# EAGLE design FLD Logic (EAGLE 6.5.0)
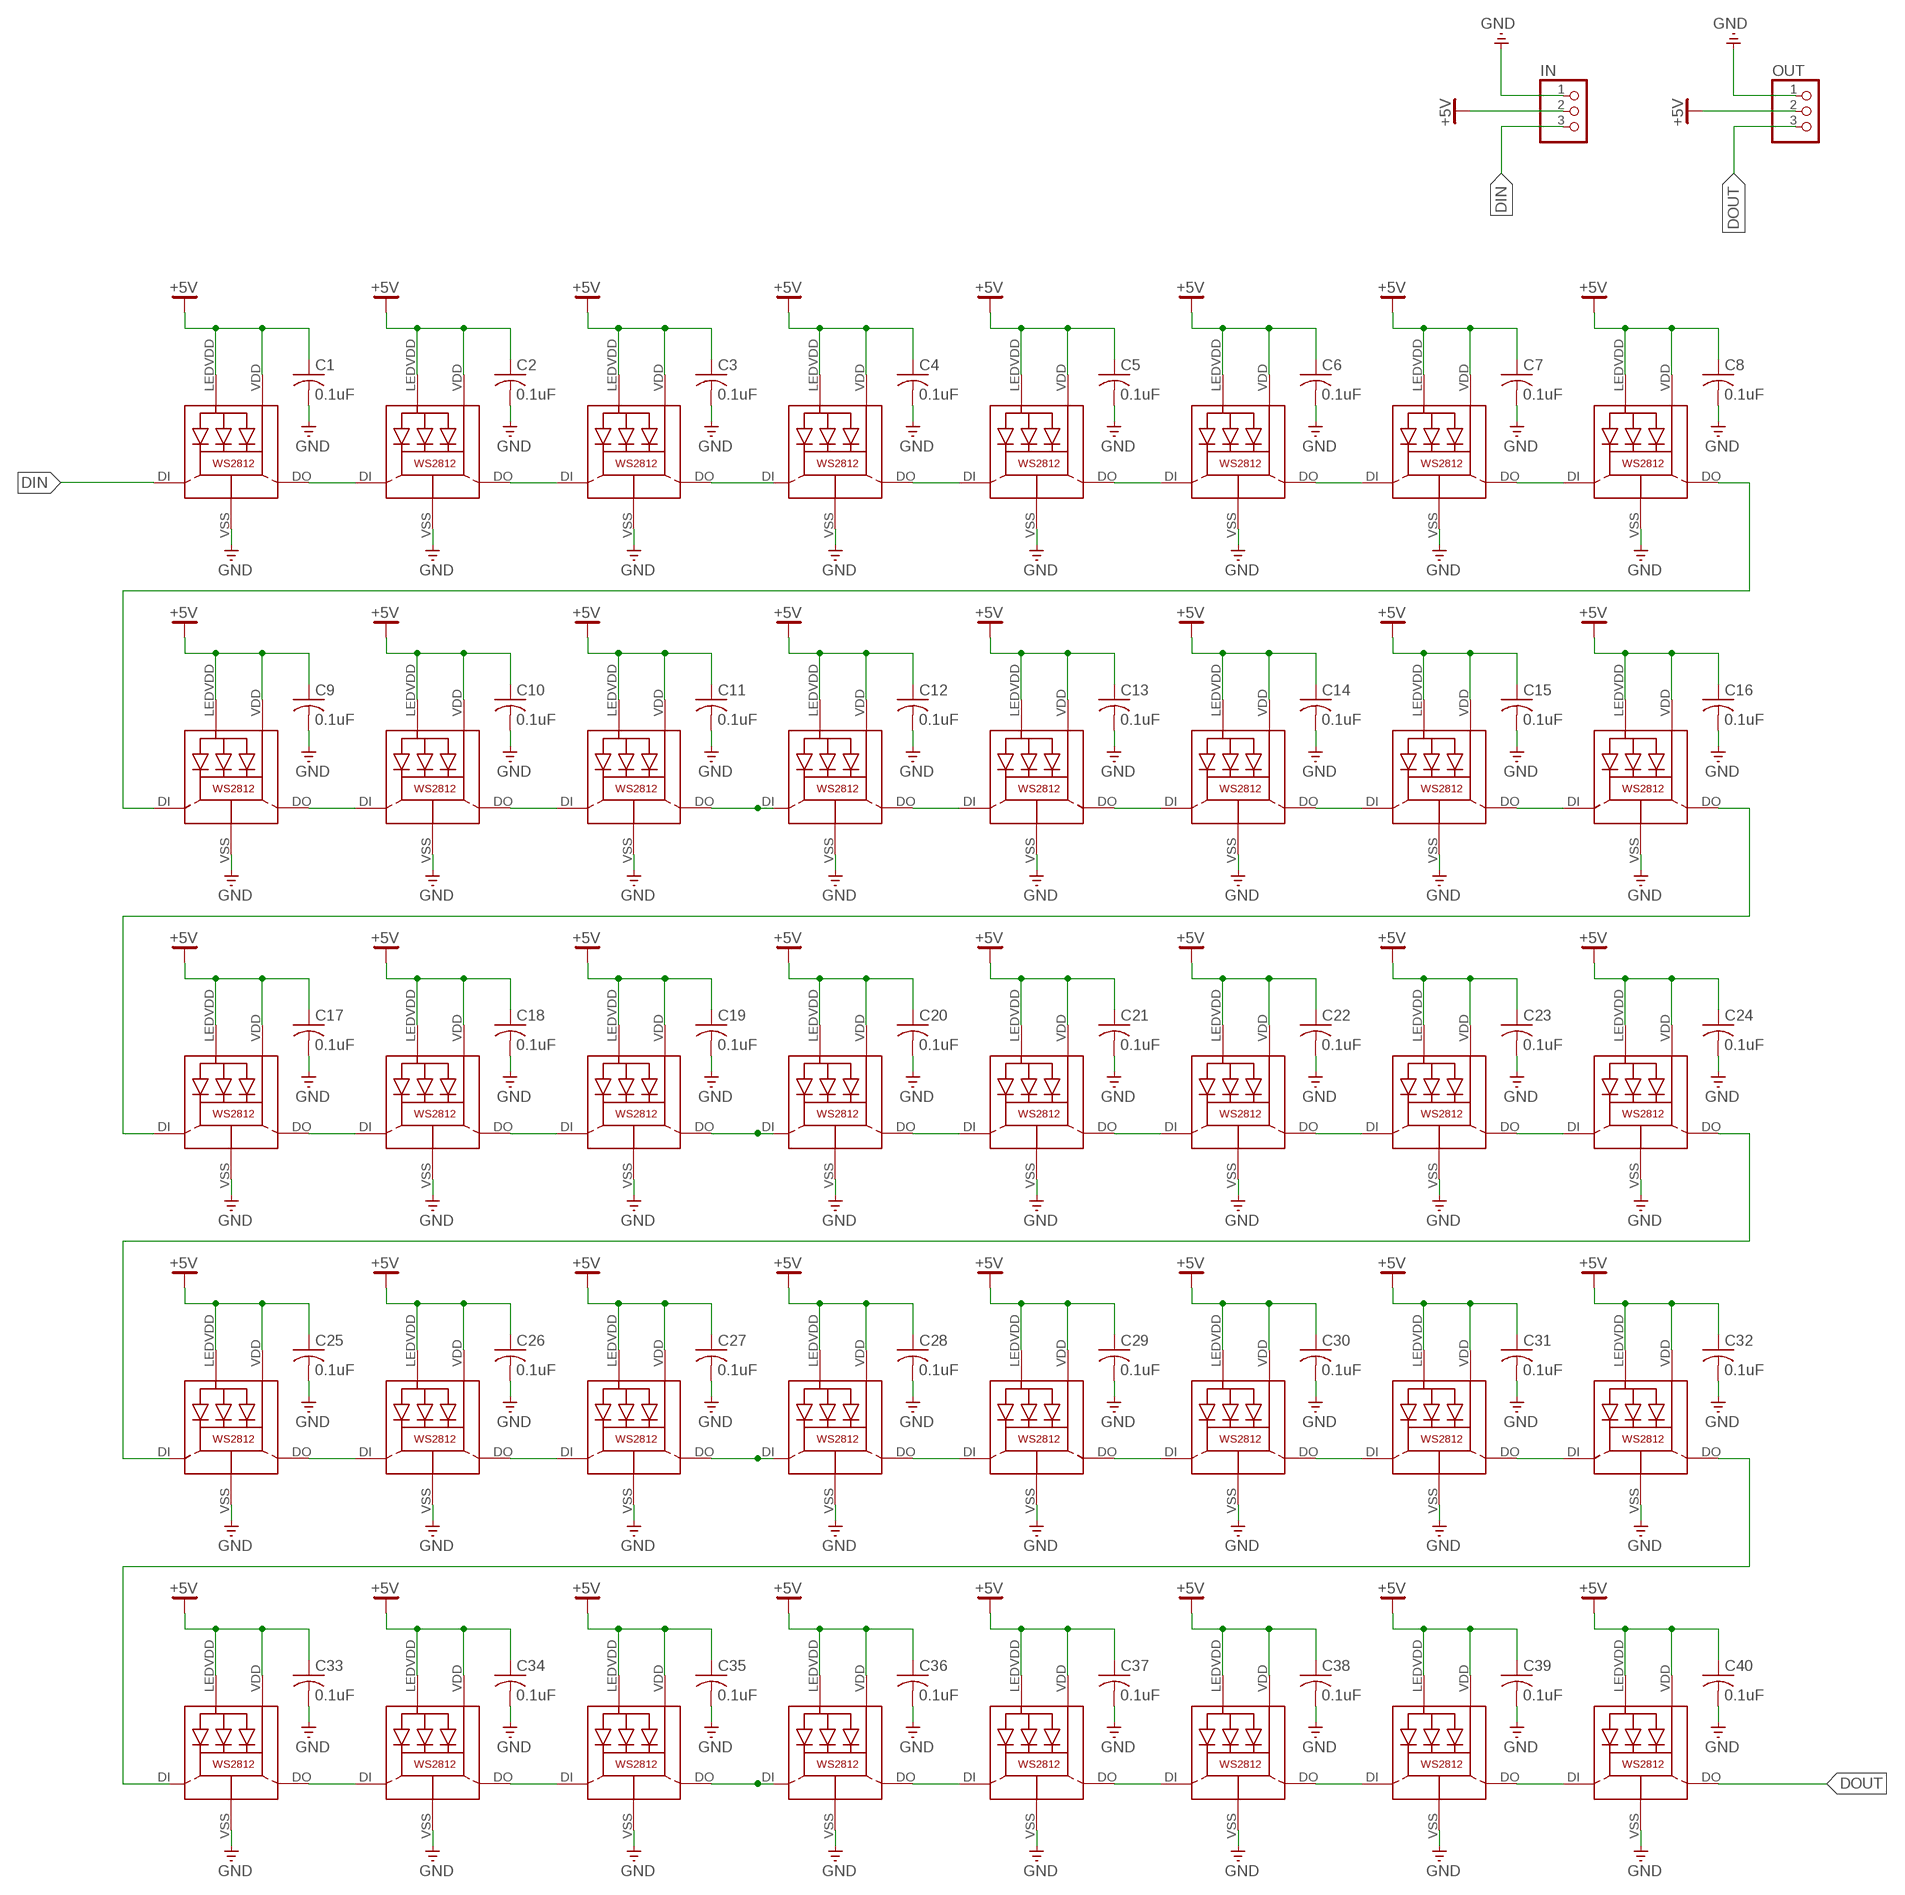
[diagram p0: schematic, sheet 1]

## Parts
C1  0.1uF  C-USC0603  [C0603]
C2  0.1uF  C-USC0603  [C0603]
C3  0.1uF  C-USC0603  [C0603]
C4  0.1uF  C-USC0603  [C0603]
C5  0.1uF  C-USC0603  [C0603]
C6  0.1uF  C-USC0603  [C0603]
C7  0.1uF  C-USC0603  [C0603]
C8  0.1uF  C-USC0603  [C0603]
C9  0.1uF  C-USC0603  [C0603]
C10  0.1uF  C-USC0603  [C0603]
C11  0.1uF  C-USC0603  [C0603]
C12  0.1uF  C-USC0603  [C0603]
C13  0.1uF  C-USC0603  [C0603]
C14  0.1uF  C-USC0603  [C0603]
C15  0.1uF  C-USC0603  [C0603]
C16  0.1uF  C-USC0603  [C0603]
C17  0.1uF  C-USC0603  [C0603]
C18  0.1uF  C-USC0603  [C0603]
C19  0.1uF  C-USC0603  [C0603]
C20  0.1uF  C-USC0603  [C0603]
C21  0.1uF  C-USC0603  [C0603]
C22  0.1uF  C-USC0603  [C0603]
C23  0.1uF  C-USC0603  [C0603]
C24  0.1uF  C-USC0603  [C0603]
C25  0.1uF  C-USC0603  [C0603]
C26  0.1uF  C-USC0603  [C0603]
C27  0.1uF  C-USC0603  [C0603]
C28  0.1uF  C-USC0603  [C0603]
C29  0.1uF  C-USC0603  [C0603]
C30  0.1uF  C-USC0603  [C0603]
C31  0.1uF  C-USC0603  [C0603]
C32  0.1uF  C-USC0603  [C0603]
C33  0.1uF  C-USC0603  [C0603]
C34  0.1uF  C-USC0603  [C0603]
C35  0.1uF  C-USC0603  [C0603]
C36  0.1uF  C-USC0603  [C0603]
C37  0.1uF  C-USC0603  [C0603]
C38  0.1uF  C-USC0603  [C0603]
C39  0.1uF  C-USC0603  [C0603]
C40  0.1uF  C-USC0603  [C0603]
IN  PINHD-1X3  [1X03]
LED1  WS2812  [WS2812]
LED2  WS2812  [WS2812]
LED3  WS2812  [WS2812]
LED4  WS2812  [WS2812]
LED5  WS2812  [WS2812]
LED6  WS2812  [WS2812]
LED7  WS2812  [WS2812]
LED8  WS2812  [WS2812]
LED9  WS2812  [WS2812]
LED10  WS2812  [WS2812]
LED11  WS2812  [WS2812]
LED12  WS2812  [WS2812]
LED13  WS2812  [WS2812]
LED14  WS2812  [WS2812]
LED15  WS2812  [WS2812]
LED16  WS2812  [WS2812]
LED17  WS2812  [WS2812]
LED18  WS2812  [WS2812]
LED19  WS2812  [WS2812]
LED20  WS2812  [WS2812]
LED21  WS2812  [WS2812]
LED22  WS2812  [WS2812]
LED23  WS2812  [WS2812]
LED24  WS2812  [WS2812]
LED25  WS2812  [WS2812]
LED26  WS2812  [WS2812]
LED27  WS2812  [WS2812]
LED28  WS2812  [WS2812]
LED29  WS2812  [WS2812]
LED30  WS2812  [WS2812]
LED31  WS2812  [WS2812]
LED32  WS2812  [WS2812]
LED33  WS2812  [WS2812]
LED34  WS2812  [WS2812]
LED35  WS2812  [WS2812]
LED36  WS2812  [WS2812]
LED37  WS2812  [WS2812]
LED38  WS2812  [WS2812]
LED39  WS2812  [WS2812]
LED40  WS2812  [WS2812]
OUT  PINHD-1X3  [1X03]

## Nets
+5V: C1.1 C2.1 C3.1 C4.1 C5.1 C6.1 C7.1 C8.1 C9.1 C10.1 C11.1 C12.1 C13.1 C14.1 C15.1 C16.1 C17.1 C18.1 C19.1 C20.1 C21.1 C22.1 C23.1 C24.1 C25.1 C26.1 C27.1 C28.1 C29.1 C30.1 C31.1 C32.1 C33.1 C34.1 C35.1 C36.1 C37.1 C38.1 C39.1 C40.1 IN.2 LED1.LEDVDD LED1.VDD LED2.LEDVDD LED2.VDD LED3.LEDVDD LED3.VDD LED4.LEDVDD LED4.VDD LED5.LEDVDD LED5.VDD LED6.LEDVDD LED6.VDD LED7.LEDVDD LED7.VDD LED8.LEDVDD LED8.VDD LED9.LEDVDD LED9.VDD LED10.LEDVDD LED10.VDD LED11.LEDVDD LED11.VDD LED12.LEDVDD LED12.VDD LED13.LEDVDD LED13.VDD LED14.LEDVDD LED14.VDD LED15.LEDVDD LED15.VDD LED16.LEDVDD LED16.VDD LED17.LEDVDD LED17.VDD LED18.LEDVDD LED18.VDD LED19.LEDVDD LED19.VDD LED20.LEDVDD LED20.VDD LED21.LEDVDD LED21.VDD LED22.LEDVDD LED22.VDD LED23.LEDVDD LED23.VDD LED24.LEDVDD LED24.VDD LED25.LEDVDD LED25.VDD LED26.LEDVDD LED26.VDD LED27.LEDVDD LED27.VDD LED28.LEDVDD LED28.VDD LED29.LEDVDD LED29.VDD LED30.LEDVDD LED30.VDD LED31.LEDVDD LED31.VDD LED32.LEDVDD LED32.VDD LED33.LEDVDD LED33.VDD LED34.LEDVDD LED34.VDD LED35.LEDVDD LED35.VDD LED36.LEDVDD LED36.VDD LED37.LEDVDD LED37.VDD LED38.LEDVDD LED38.VDD LED39.LEDVDD LED39.VDD LED40.LEDVDD LED40.VDD OUT.2
DIN: IN.3 LED1.DI
DOUT: LED40.DO OUT.3
GND: C1.2 C2.2 C3.2 C4.2 C5.2 C6.2 C7.2 C8.2 C9.2 C10.2 C11.2 C12.2 C13.2 C14.2 C15.2 C16.2 C17.2 C18.2 C19.2 C20.2 C21.2 C22.2 C23.2 C24.2 C25.2 C26.2 C27.2 C28.2 C29.2 C30.2 C31.2 C32.2 C33.2 C34.2 C35.2 C36.2 C37.2 C38.2 C39.2 C40.2 IN.1 LED1.VSS(GND) LED2.VSS(GND) LED3.VSS(GND) LED4.VSS(GND) LED5.VSS(GND) LED6.VSS(GND) LED7.VSS(GND) LED8.VSS(GND) LED9.VSS(GND) LED10.VSS(GND) LED11.VSS(GND) LED12.VSS(GND) LED13.VSS(GND) LED14.VSS(GND) LED15.VSS(GND) LED16.VSS(GND) LED17.VSS(GND) LED18.VSS(GND) LED19.VSS(GND) LED20.VSS(GND) LED21.VSS(GND) LED22.VSS(GND) LED23.VSS(GND) LED24.VSS(GND) LED25.VSS(GND) LED26.VSS(GND) LED27.VSS(GND) LED28.VSS(GND) LED29.VSS(GND) LED30.VSS(GND) LED31.VSS(GND) LED32.VSS(GND) LED33.VSS(GND) LED34.VSS(GND) LED35.VSS(GND) LED36.VSS(GND) LED37.VSS(GND) LED38.VSS(GND) LED39.VSS(GND) LED40.VSS(GND) OUT.1
N$1: LED4.DO LED5.DI
N$2: LED5.DO LED6.DI
N$3: LED3.DO
N$4: LED7.DO LED8.DI
N$5: LED6.DO LED7.DI
N$6: LED17.DO LED18.DI
N$7: LED9.DO LED10.DI
N$8: LED10.DO LED11.DI
N$9: LED12.DO LED13.DI
N$10: LED13.DO LED14.DI
N$11: LED1.DO LED2.DI
N$12: LED2.DO LED3.DI
N$13: LED11.DO LED12.DI
N$14: LED15.DO LED16.DI
N$15: LED14.DO LED15.DI
N$16: LED16.DO LED17.DI
N$17: LED18.DO LED19.DI
N$18: LED20.DO LED21.DI
N$19: LED21.DO LED22.DI
N$20: LED19.DO LED20.DI
N$21: LED23.DO LED24.DI
N$22: LED22.DO LED23.DI
N$23: LED24.DO
N$24: LED25.DO LED26.DI
N$25: LED26.DO LED27.DI
N$26: LED28.DO LED29.DI
N$27: LED29.DO LED30.DI
N$28: LED27.DO LED28.DI
N$29: LED31.DO LED32.DI
N$30: LED30.DO LED31.DI
N$31: LED32.DO
N$32: LED33.DO LED34.DI
N$33: LED34.DO LED35.DI
N$34: LED36.DO LED37.DI
N$35: LED37.DO LED38.DI
N$36: LED35.DO LED36.DI
N$37: LED39.DO LED40.DI
N$38: LED38.DO LED39.DI
N$41: LED8.DO LED9.DI
Unconnected: LED4.DI LED25.DI LED33.DI

## Library data of the parts
C1-C40 = adafruit:C-US: CAPACITOR, American symbol
IN OUT = pinhead:PINHD-1X3: PIN HEADER
LED1-LED40 = adafruit:WS2812

## Board
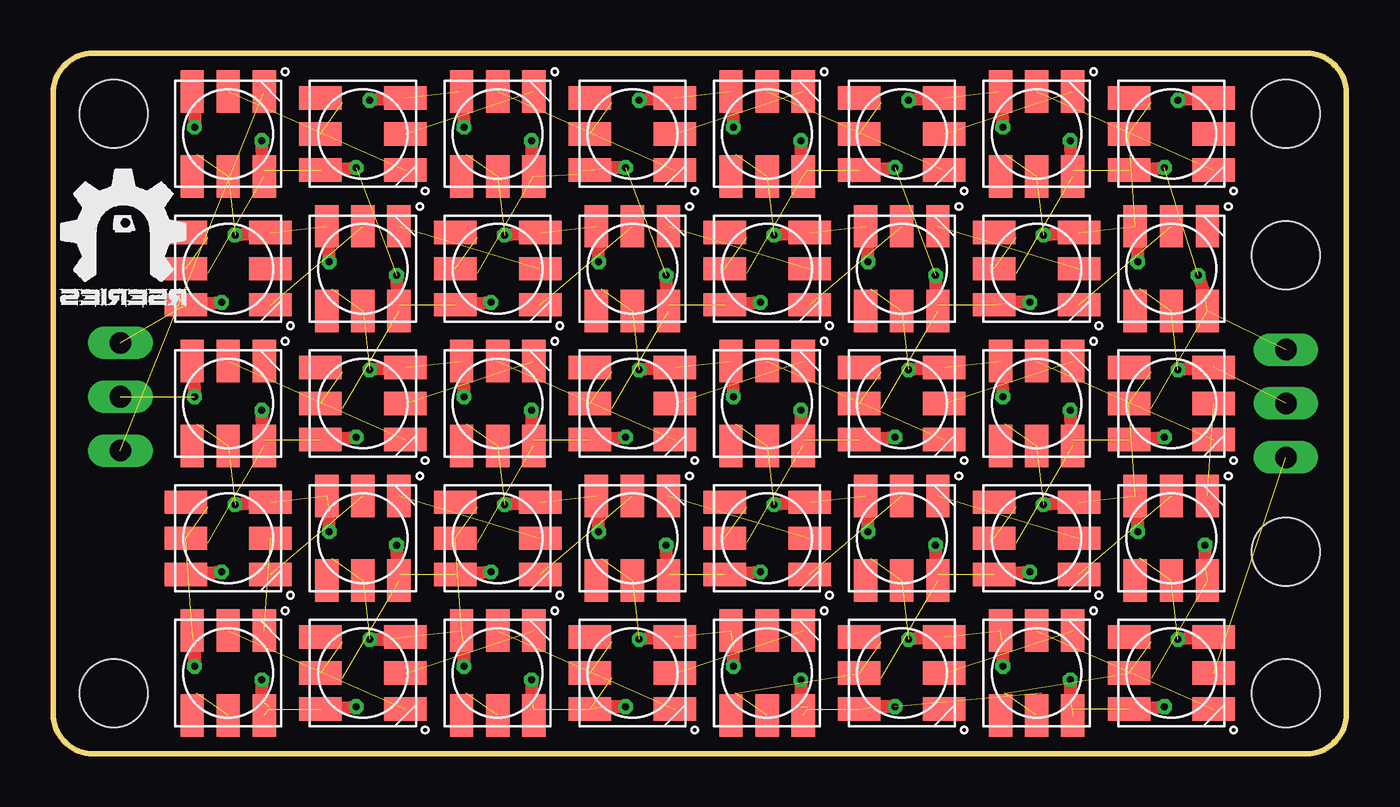
[diagram p1: board, top side]
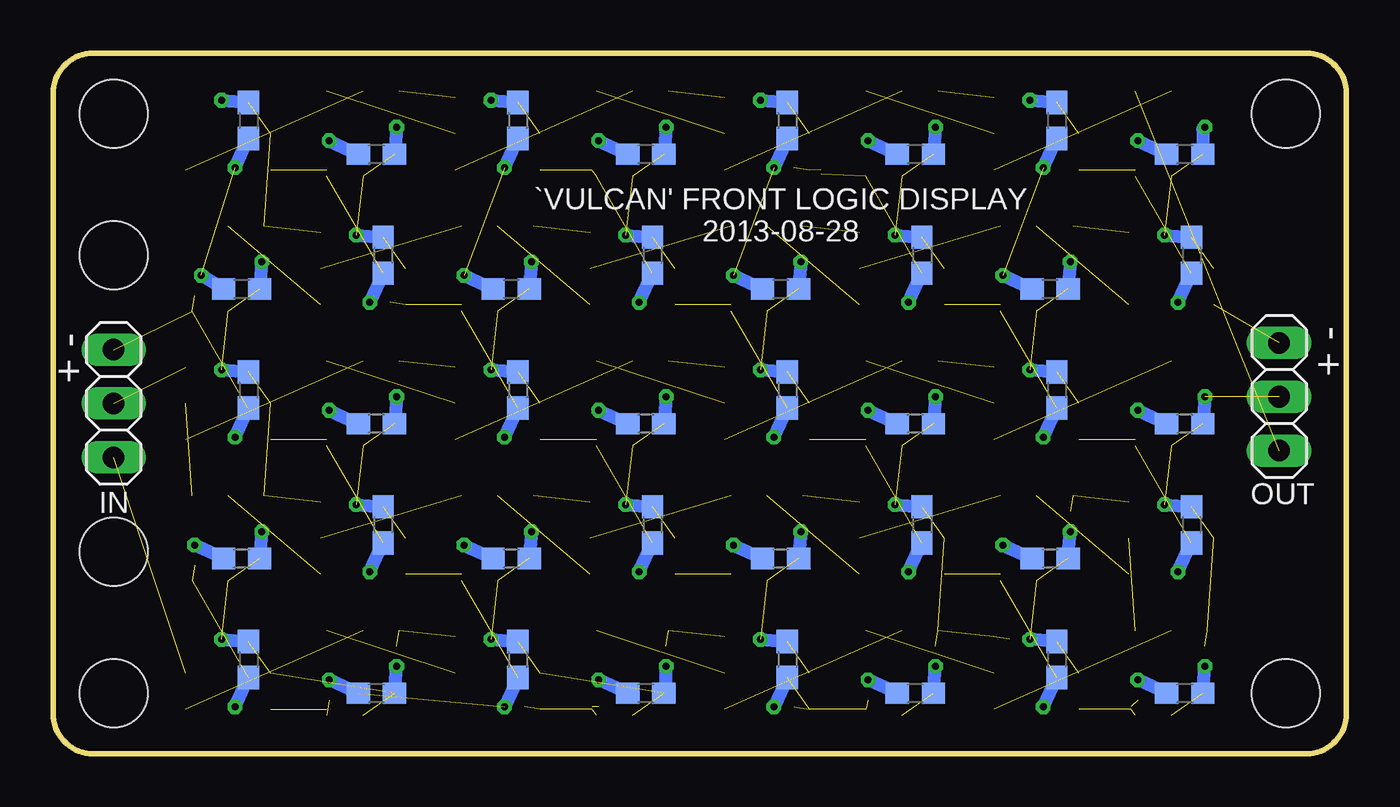
[diagram p2: board, bottom side, seen from below]

Size 60.96 x 33.02 mm. Coordinates in mm from the lower left corner, seen from the top.
Outline: 0,1.91 0,31.11 arc-90 1.91,33.02 59.06,33.02 arc-90 60.96,31.11 60.96,1.91 arc-90 59.06,0 1.91,0 arc-90 0,1.91
Copper layers (1*16): Top 0.0356mm / dielectric 1.5011mm / Bottom 0.0356mm
Design rules "LaenPCBOrder *": minimum track width 12mil, minimum drill 13mil, track to track 6mil, track to pad 6mil, pad to pad 6mil, via to via 6mil, smd to smd 6mil, copper to edge 15mil, drill to drill 6mil, minimum pad ring 7mil, minimum via ring 7mil, stop-mask expansion 4mil, vias tented up to drill 0mil, thermal gap 10mil
Holes 3.2 mm at 58.1,30.16 58.1,2.86 2.86,2.86 2.86,30.16 58.1,9.53 58.1,23.5

### Footprints (pad centres in the part's own frame; a part is rotated, then mirrored left to right if it is on the bottom)
C0603 = smd 1.1 x 1: 1 -0.85,0; 2 0.85,0
1X03 = drill 1.016 long: 1 -2.54,0; 2 0,0; 3 2.54,0
WS2812 = smd 2 x 1.1: DI 2,0; DO 2,-1.7; LEDVDD -2,0; NC -2,1.7; VDD 2,1.7; VSS -2,-1.7

### Placement (x,y rotation side)
C1  51.75,4.45 270 bottom
C2  45.72,2.86 180 bottom
C3  39.05,4.45 270 bottom
C4  33.02,2.86 180 bottom
C5  26.35,4.45 270 bottom
C6  20.32,2.86 180 bottom
C7  13.65,4.45 270 bottom
C8  7.62,2.86 180 bottom
C9  7.3,10.79 270 bottom
C10  13.97,9.21 180 bottom
C11  20,10.79 270 bottom
C12  26.67,9.21 180 bottom
C13  32.7,10.79 270 bottom
C14  39.37,9.21 180 bottom
C15  45.4,10.79 270 bottom
C16  52.07,9.21 180 bottom
C17  51.75,17.14 270 bottom
C18  45.72,15.56 180 bottom
C19  39.05,17.14 270 bottom
C20  33.02,15.56 180 bottom
C21  26.35,17.14 270 bottom
C22  20.32,15.56 180 bottom
C23  13.65,17.14 270 bottom
C24  7.62,15.56 180 bottom
C25  7.3,23.5 270 bottom
C26  13.97,21.91 180 bottom
C27  20,23.5 270 bottom
C28  26.67,21.91 180 bottom
C29  32.7,23.5 270 bottom
C30  39.37,21.91 180 bottom
C31  45.4,23.5 270 bottom
C32  52.07,21.91 180 bottom
C33  51.75,29.84 270 bottom
C34  45.72,28.26 180 bottom
C35  39.05,29.84 270 bottom
C36  33.02,28.26 180 bottom
C37  26.35,29.84 270 bottom
C38  20.32,28.26 180 bottom
C39  13.65,29.84 270 bottom
C40  7.62,28.26 180 bottom
IN  58.1,16.51 270 bottom
LED1  52.7,3.81 0 top
LED2  46.35,3.81 90 top
LED3  40,3.81 0 top
LED4  33.65,3.81 90 top
LED5  27.3,3.81 0 top
LED6  20.96,3.81 90 top
LED7  14.6,3.81 0 top
LED8  8.25,3.81 90 top
LED9  8.25,10.16 0 top
LED10  14.6,10.16 90 top
LED11  20.96,10.16 0 top
LED12  27.3,10.16 90 top
LED13  33.65,10.16 0 top
LED14  40,10.16 90 top
LED15  46.35,10.16 0 top
LED16  52.7,10.16 90 top
LED17  52.7,16.51 0 top
LED18  46.35,16.51 90 top
LED19  40,16.51 0 top
LED20  33.65,16.51 90 top
LED21  27.3,16.51 0 top
LED22  20.96,16.51 90 top
LED23  14.6,16.51 0 top
LED24  8.25,16.51 90 top
LED25  8.25,22.86 0 top
LED26  14.6,22.86 90 top
LED27  20.96,22.86 0 top
LED28  27.3,22.86 90 top
LED29  33.65,22.86 0 top
LED30  40,22.86 90 top
LED31  46.35,22.86 0 top
LED32  52.7,22.86 90 top
LED33  52.7,29.21 0 top
LED34  46.35,29.21 90 top
LED35  40,29.21 0 top
LED36  33.65,29.21 90 top
LED37  27.3,29.21 0 top
LED38  20.96,29.21 90 top
LED39  14.6,29.21 0 top
LED40  8.25,29.21 90 top
OUT  3.18,16.83 270 bottom
U$1  [RSERIES-OSHW-LOGO-SMALL]  6.67,27.94 270 bottom

### Tracks (layer width: path | path; a pad name or v marks a point on that pad's centre or on a via)
+5V  (via drill 0.33 pad 0.25)  (87 unrouted)
  Top 0.61: v6.67,4.13 6.67,5.08 | v14.92,5.4 15.87,5.4 | v19.37,4.13 19.37,5.08 | LED5.VDD v27.62,5.4 | LED3.VDD v40.32,5.4 | LED1.VDD v53.02,5.4 | LED16.VDD v51.12,10.48 | LED15.VDD v46.67,11.75 | LED14.VDD v38.42,10.48 | LED13.VDD v33.97,11.75 | LED12.VDD v25.72,10.48 | LED11.VDD v21.27,11.75 | v13.02,10.48 13.02,11.43 | LED9.VDD v8.57,11.75 | LED24.VDD v6.67,16.83 | LED25.VDD v8.57,24.45 | LED26.VDD v13.02,23.18 | LED23.VDD v14.92,18.1 | LED22.VDD v19.37,16.83 | LED27.VDD v21.27,24.45 | LED21.VDD v27.62,18.1 | LED20.VDD v32.07,16.83 | LED19.VDD v40.32,18.1 | LED18.VDD v44.77,16.83 | LED17.VDD v53.02,18.1 | LED32.VDD v51.12,23.18 | LED31.VDD v46.67,24.45 | LED30.VDD v38.42,23.18 | LED29.VDD v33.97,24.45 | LED28.VDD v25.72,23.18 | LED39.VDD v14.92,30.8 | LED38.VDD v19.37,29.53 | LED37.VDD v27.62,30.8 | LED36.VDD v32.07,29.53 | LED35.VDD v40.32,30.8 | LED34.VDD v44.77,29.53 | LED33.VDD v53.02,30.8 | LED40.VDD 6.67,31.1 v6.67,29.53 | v32.07,4.13 32.07,5.08 | v44.77,4.13 44.77,5.08
  Bottom 0.61: C8.1 v6.67,4.13 | C7.1 v14.92,5.4 | C6.1 v19.37,4.13 | v27.62,5.4 C5.1 | v40.32,5.4 C3.1 | v53.02,5.4 C1.1 | v51.12,10.48 C16.1 | v46.67,11.75 C15.1 | v38.42,10.48 C14.1 | v33.97,11.75 C13.1 | v25.72,10.48 C12.1 | v21.27,11.75 C11.1 | C10.1 v13.02,10.48 | v8.57,11.75 C9.1 | v6.67,16.83 C24.1 | v8.57,24.45 C25.1 | v13.02,23.18 C26.1 | v14.92,18.1 C23.1 | v19.37,16.83 C22.1 | v21.27,24.45 C27.1 | v27.62,18.1 C21.1 | v32.07,16.83 C20.1 | v40.32,18.1 C19.1 | v44.77,16.83 C18.1 | v53.02,18.1 C17.1 | v51.12,23.18 C32.1 | v46.67,24.45 C31.1 | v38.42,23.18 C30.1 | v33.97,24.45 C29.1 | v25.72,23.18 C28.1 | v14.92,30.8 C39.1 | v19.37,29.53 C38.1 | v27.62,30.8 C37.1 | v32.07,29.53 C36.1 | v40.32,30.8 C35.1 | v44.77,29.53 C34.1 | v53.02,30.8 C33.1 | v6.67,29.53 6.77,29.43 C40.1 | C4.1 32.07,2.86 v32.07,4.13 | C2.1 v44.77,4.13
DIN  (1 unrouted)
DOUT  (1 unrouted)
GND  (via drill 0.33 pad 0.25)  (55 unrouted)
  Top 0.61: v9.84,3.49 9.84,2.54 | LED7.VSS v14.29,2.22 | v22.54,3.49 22.54,2.54 | v39.69,2.22 38.74,2.22 | LED13.VSS v33.34,8.57 | LED1.VSS v52.39,2.22 | v54.29,9.84 54.29,8.89 | LED15.VSS v46.04,8.57 | v41.59,9.84 LED14.VSS 41.71,8.46 | v28.89,9.84 LED12.VSS 29.01,8.46 | LED11.VSS v20.64,8.57 | v16.19,9.84 LED10.VSS 16.3,8.46 | LED9.VSS v7.94,8.57 | v9.84,16.19 LED24.VSS 9.96,14.81 | LED25.VSS v7.94,21.27 | v16.19,22.54 LED26.VSS 16.3,21.16 | LED23.VSS v14.29,14.92 | LED27.VSS v20.64,21.27 | v22.54,16.19 LED22.VSS 22.66,14.81 | LED21.VSS v26.99,14.92 | v35.24,16.19 LED20.VSS 35.35,14.81 | LED19.VSS v39.69,14.92 | v47.94,16.19 LED18.VSS 48.06,14.81 | LED17.VSS v52.39,14.92 | v53.97,22.54 54.29,21.59 | v46.04,21.27 45.09,21.27 | v41.59,22.54 LED30.VSS 41.71,21.16 | LED29.VSS v33.34,21.27 | v28.89,22.54 LED28.VSS 29.01,21.16 | v9.84,28.89 LED40.VSS 9.96,27.51 | LED39.VSS v14.29,27.62 | LED38.VSS v22.54,28.89 | v26.99,27.62 26.03,27.62 | LED36.VSS v35.24,28.89 | LED35.VSS v39.69,27.62 | v47.94,28.89 LED34.VSS 48.06,27.51 | LED33.VSS v52.39,27.62 | 48.06,2.11 LED2.VSS | 35.56,2.11 35.56,2.22 | 22.66,2.11 LED6.VSS | 10.16,2.11 10.16,2.22 | 35.56,27.51 35.56,27.62 | 24.76,27.53 24.76,27.3 | v35.24,3.49 35.24,2.22 | v47.94,3.49 47.94,2.54 | v26.99,2.22 26.03,2.22
  Bottom 0.61: C8.2 v9.84,3.49 | v14.29,2.22 C7.2 | C6.2 v22.54,3.49 | C3.2 v39.69,2.22 | v33.34,8.57 C13.2 | v52.39,2.22 C1.2 | C16.2 v54.29,9.84 | v46.04,8.57 C15.2 | v41.59,9.84 C14.2 | v28.89,9.84 C12.2 | v20.64,8.57 C11.2 | v16.19,9.84 C10.2 | v7.94,8.57 C9.2 | v9.84,16.19 C24.2 | v7.94,21.27 C25.2 | v16.19,22.54 C26.2 | v14.29,14.92 C23.2 | v20.64,21.27 C27.2 | v22.54,16.19 C22.2 | v26.99,14.92 C21.2 | v35.24,16.19 C20.2 | v39.69,14.92 C19.2 | v47.94,16.19 C18.2 | v52.39,14.92 C17.2 | C32.2 v53.97,22.54 | C31.2 v46.04,21.27 | v41.59,22.54 C30.2 | v33.34,21.27 C29.2 | v28.89,22.54 C28.2 | v9.84,28.89 C40.2 | v14.29,27.62 C39.2 | v22.54,28.89 C38.2 | C37.2 v26.99,27.62 | v35.24,28.89 C36.2 | v39.69,27.62 C35.2 | v47.94,28.89 C34.2 | v52.39,27.62 C33.2 | C4.2 v35.24,3.49 | C2.2 v47.94,3.49 | C5.2 v26.99,2.22
N$1  (1 unrouted)
N$2  (1 unrouted)
N$4  (1 unrouted)
N$5  (1 unrouted)
N$6  (1 unrouted)
N$7  (1 unrouted)
N$8  (1 unrouted)
N$9  (1 unrouted)
N$10  (1 unrouted)
N$11  (1 unrouted)
N$12  (1 unrouted)
N$13  (1 unrouted)
N$14  (1 unrouted)
N$15  (1 unrouted)
N$16  (1 unrouted)
N$17  (1 unrouted)
N$18  (1 unrouted)
N$19  (1 unrouted)
N$20  (1 unrouted)
N$21  (1 unrouted)
N$22  (1 unrouted)
N$24  (1 unrouted)
N$25  (1 unrouted)
N$26  (1 unrouted)
N$27  (1 unrouted)
N$28  (1 unrouted)
N$29  (1 unrouted)
N$30  (1 unrouted)
N$32  (1 unrouted)
N$33  (1 unrouted)
N$34  (1 unrouted)
N$35  (1 unrouted)
N$36  (1 unrouted)
N$37  (1 unrouted)
N$38  (1 unrouted)
N$41  (1 unrouted)

### Text on the board
bNames: + - | + -
_bsilk: `VULCAN' FRONT LOGIC DISPLAY / 2013-08-28